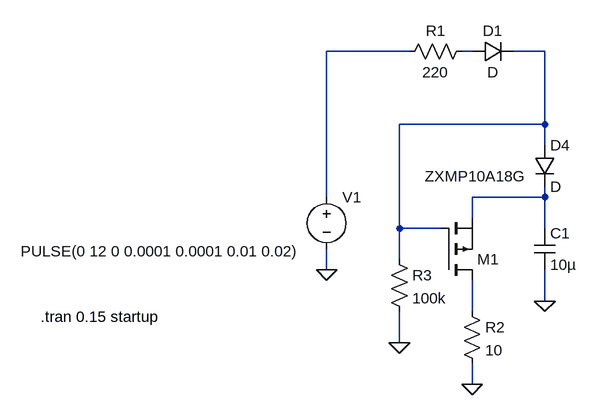
[diagram p0: schematic CapDischarge_PMOS.asc]
CapDischarge_PMOS.asc, the LTspice schematic file:
Version 4
SHEET 1 880 680
WIRE 176 -96 48 -96
WIRE 272 -96 256 -96
WIRE 384 -96 336 -96
WIRE 384 16 384 -96
WIRE 384 16 160 16
WIRE 384 48 384 16
WIRE 48 128 48 -96
WIRE 384 128 384 112
WIRE 384 128 272 128
WIRE 272 160 272 128
WIRE 160 176 160 16
WIRE 224 176 160 176
WIRE 384 176 384 128
WIRE 160 224 160 176
WIRE 48 240 48 208
WIRE 384 288 384 240
WIRE 272 304 272 256
WIRE 160 352 160 304
WIRE 272 416 272 384
FLAG 48 240 0
FLAG 384 288 0
FLAG 272 416 0
FLAG 160 352 0
SYMBOL voltage 48 112 R0
WINDOW 3 -471 99 Left 2
WINDOW 123 0 0 Left 0
WINDOW 39 0 0 Left 0
SYMATTR Value PULSE(0 12 0 0.0001 0.0001 0.01 0.02)
SYMATTR InstName V1
SYMBOL res 272 -112 R90
WINDOW 0 0 56 VBottom 2
WINDOW 3 32 56 VTop 2
SYMATTR InstName R1
SYMATTR Value 220
SYMBOL cap 368 176 R0
SYMATTR InstName C1
SYMATTR Value 10µ
SYMBOL pmos 224 256 M180
WINDOW 3 -25 160 Left 2
SYMATTR InstName M1
SYMATTR Value ZXMP10A18G
SYMBOL res 144 208 R0
SYMATTR InstName R3
SYMATTR Value 100k
SYMBOL diode 368 48 R0
SYMATTR InstName D4
SYMBOL diode 272 -80 R270
WINDOW 0 32 32 VTop 2
WINDOW 3 0 32 VBottom 2
SYMATTR InstName D1
SYMBOL res 256 288 R0
SYMATTR InstName R2
SYMATTR Value 10
TEXT -392 312 Left 2 !.tran 0.15 startup

The netlist it stands for:
* CapDischarge_PMOS.asc
V1 N001 0 PULSE(0 12 0 0.0001 0.0001 0.01 0.02)
R1 N002 N001 220
C1 N004 0 10µ
M1 N005 N003 N004 N004 ZXMP10A18G
R3 N003 0 100k
D4 N003 N004 D
D1 N002 N003 D
R2 N005 0 10
.model D D
.lib standard.dio
.model NMOS NMOS
.model PMOS PMOS
.lib standard.mos
.tran 0.15 startup
.backanno
.end